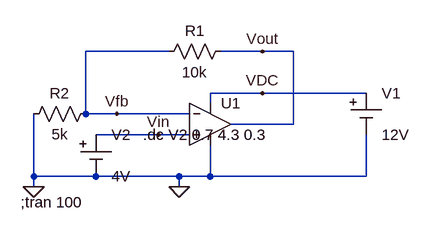
[diagram p0: schematic F2V_Gain_Amp.asc]
F2V_Gain_Amp.asc, the LTspice schematic file:
Version 4
SHEET 1 880 680
WIRE 192 16 64 16
WIRE 336 16 272 16
WIRE 384 16 336 16
WIRE 336 80 256 80
WIRE 496 80 336 80
WIRE 256 96 256 80
WIRE 64 112 64 16
WIRE 112 112 64 112
WIRE 224 112 112 112
WIRE 384 128 384 16
WIRE 384 128 288 128
WIRE 176 144 80 144
WIRE 224 144 176 144
WIRE -16 208 -16 112
WIRE 80 208 -16 208
WIRE 208 208 80 208
WIRE 256 208 256 160
WIRE 256 208 208 208
WIRE 496 208 496 144
WIRE 496 208 256 208
WIRE -16 224 -16 208
WIRE 208 224 208 208
FLAG -16 224 0
FLAG 208 224 0
FLAG 336 80 VDC
FLAG 112 112 Vfb
FLAG 336 16 Vout
FLAG 176 144 Vin
SYMBOL OpAmps\\UniversalOpAmp1 256 128 R0
SYMATTR InstName U1
SYMBOL res 288 0 R90
WINDOW 0 0 56 VBottom 2
WINDOW 3 32 56 VTop 2
SYMATTR InstName R1
SYMATTR Value 10k
SYMBOL res 80 96 R90
WINDOW 0 0 56 VBottom 2
WINDOW 3 32 56 VTop 2
SYMATTR InstName R2
SYMATTR Value 5k
SYMBOL Misc\\cell 496 80 R0
WINDOW 123 0 0 Left 0
WINDOW 39 0 0 Left 0
SYMATTR InstName V1
SYMATTR Value 12V
SYMBOL Misc\\cell 80 144 R0
WINDOW 123 0 0 Left 0
WINDOW 39 0 0 Left 0
SYMATTR InstName V2
SYMATTR Value 4V
TEXT -36 248 Left 2 !;tran 100
TEXT 152 144 Left 2 !.dc V2 0.7 4.3 0.3

The netlist it stands for:
* F2V_Gain_Amp.asc
XU1 Vin Vfb VDC 0 Vout level1 Avol=1Meg GBW=10Meg Vos=0 En=0 Enk=0 In=0 Ink=0 Rin=500Meg  ; pins In+ In- V+ V- OUT
R1 Vout Vfb 10k
R2 Vfb 0 5k
V1 VDC 0 12V
V2 Vin 0 4V
;tran 100
.dc V2 0.7 4.3 0.3
.lib UniversalOpAmp1.lib
.backanno
.end